# EAGLE design Carte principale v2 (EAGLE 6.3)
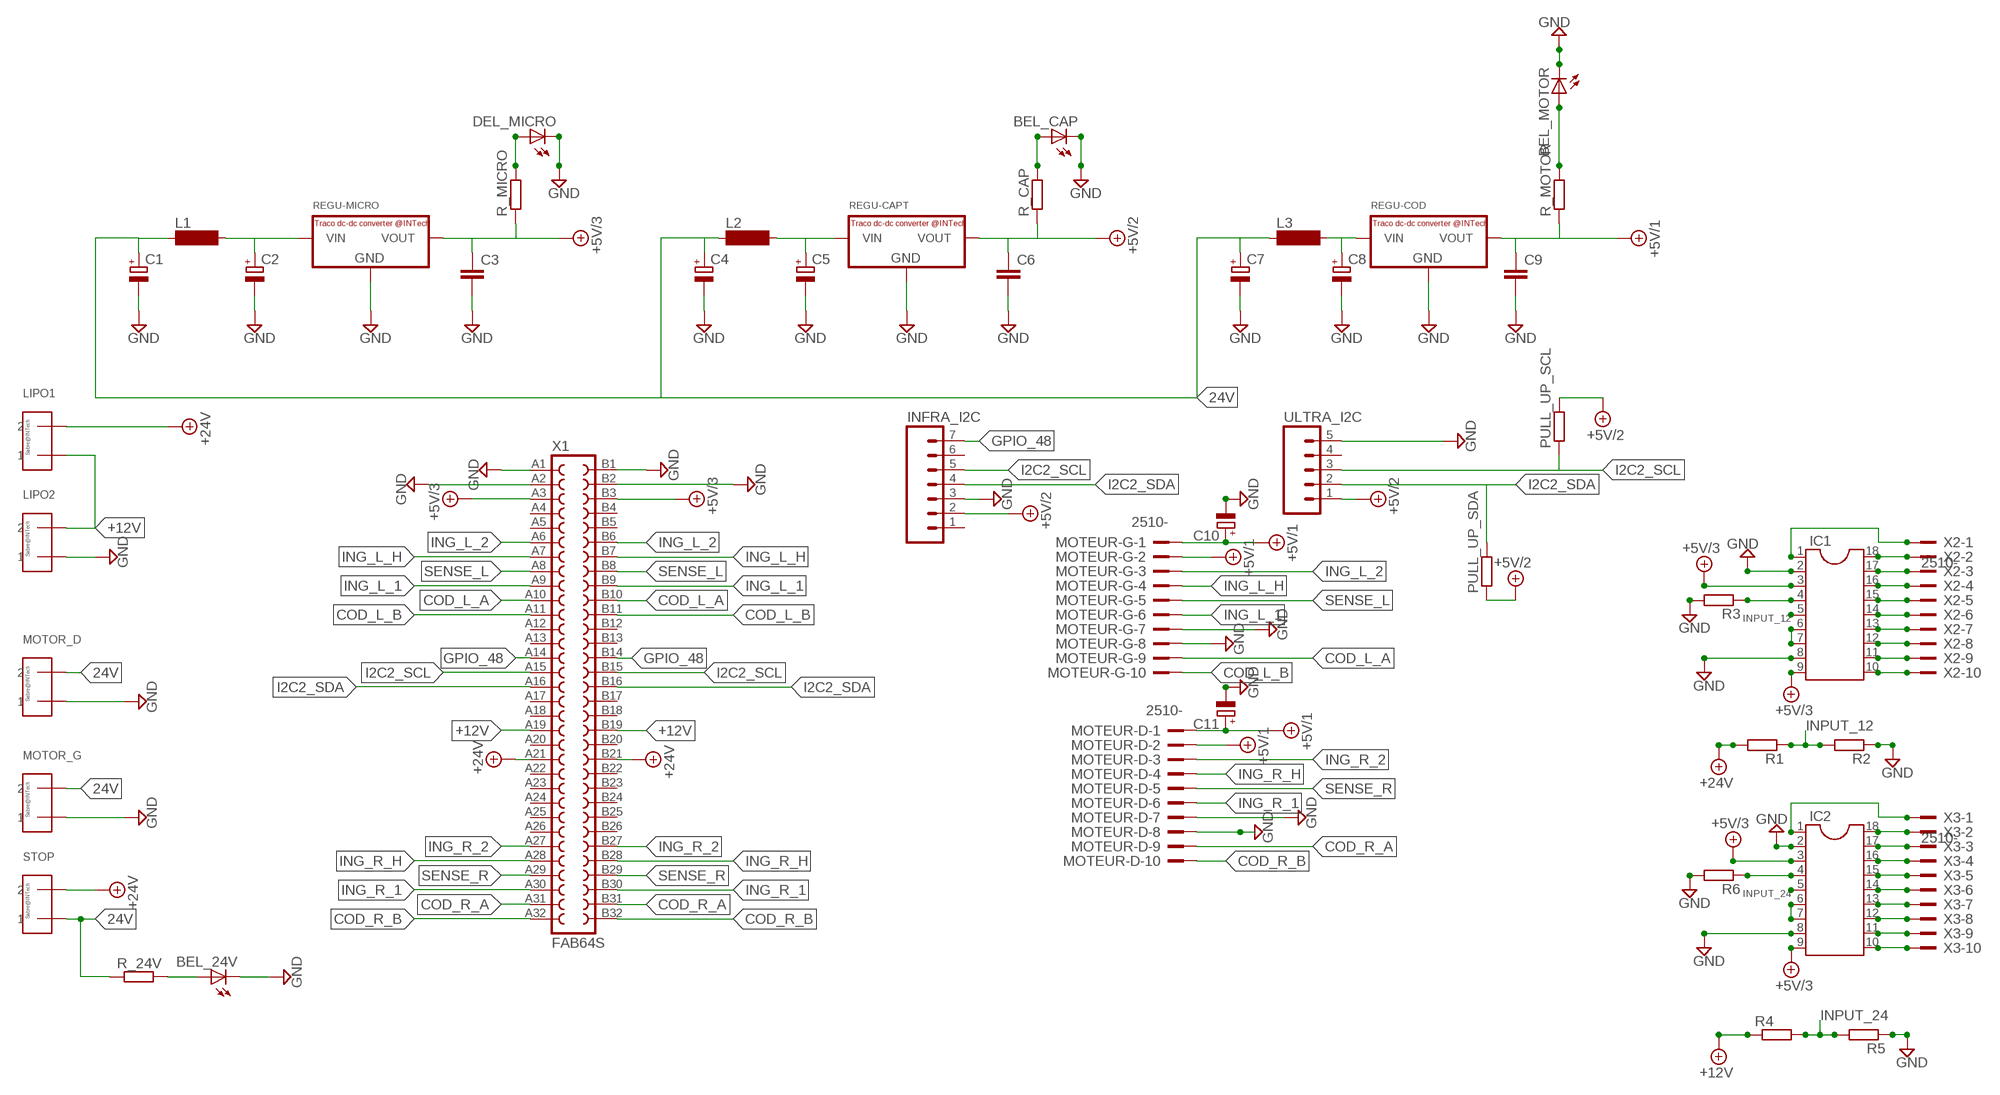
[diagram p0: schematic, sheet 1]

## Parts
BEL_24V  LED5MM  [LED5MM]
BEL_CAP  LED5MM  [LED5MM]
BEL_MOTOR  LED5MM  [LED5MM]
C1  CPOL-EUE2.5-6  [E2,5-6]
C2  CPOL-EUE2.5-6  [E2,5-6]
C3  C-EU050-025X075  [C050-025X075]
C4  CPOL-EUE2.5-6  [E2,5-6]
C5  CPOL-EUE2.5-6  [E2,5-6]
C6  C-EU050-025X075  [C050-025X075]
C7  CPOL-EUE2.5-6  [E2,5-6]
C8  CPOL-EUE2.5-6  [E2,5-6]
C9  C5/3  [C5B3]
C10  CPOL-EUE2.5-6  [E2,5-6]
C11  CPOL-EUE2.5-6  [E2,5-6]
DEL_MICRO  LED5MM  [LED5MM]
IC1  DIL18S  [SOCKET-18]
IC2  DIL18S  [SOCKET-18]
INFRA_I2C  M07  [07P]
L1  SD12-1000  [SD12_1000]
L2  SD12-1000  [SD12_1000]
L3  SD12-1000  [SD12_1000]
LIPO1  43160  [43160]
LIPO2  43160  [43160]
MOTEUR-D  2510-  [PAK100/2500-10]
MOTEUR-G  2510-  [PAK100/2500-10]
MOTOR_D  43160  [43160]
MOTOR_G  43160  [43160]
PULL_UP_SCL  R-EU_0204/7  [0204/7]
PULL_UP_SDA  R-EU_0204/7  [0204/7]
R1  R-EU_0204/7  [0204/7]
R2  R-EU_0204/7  [0204/7]
R3  R-EU_0204/7  [0204/7]
R4  R-EU_0204/7  [0204/7]
R5  R-EU_0204/7  [0204/7]
R6  R-EU_0204/7  [0204/7]
R_24V  R-EU_0204/7  [0204/7]
R_CAP  R-EU_0204/7  [0204/7]
R_MICRO  R-EU_0204/7  [0204/7]
R_MOTOR  R-EU_0204/7  [0204/7]
REGU-CAPT  R-78C-1.0_INTECH  [SIP3_INTECH]
REGU-COD  R-78C-1.0_INTECH  [SIP3_INTECH]
REGU-MICRO  R-78C-1.0_INTECH  [SIP3_INTECH]
STOP  43160  [43160]
ULTRA_I2C  M05  [05P]
X1  FAB64S  [FAB64S]
X2  2510-  [PAK100/2500-10]
X3  2510-  [PAK100/2500-10]

## Nets
24V: C1.+ C4.+ C7.+ L1.1 L2.1 L3.1 MOTOR_D.2_1 MOTOR_D.2_2 MOTOR_G.2_1 MOTOR_G.2_2 R_24V.1 STOP.1_1 STOP.1_2
+5V/1: C9.1 C10.+ C11.+ MOTEUR-D.1 MOTEUR-D.2 MOTEUR-G.1 MOTEUR-G.2 R_MOTOR.1 REGU-COD.VOUT
+5V/2: C6.1 INFRA_I2C.2 PULL_UP_SCL.2 PULL_UP_SDA.1 R_CAP.1 REGU-CAPT.VOUT ULTRA_I2C.1
+5V/3: C3.1 IC1.3 IC1.9 IC2.3 IC2.9 R_MICRO.1 REGU-MICRO.VOUT X1.A3 X1.B3
+12V: LIPO1.1_1 LIPO1.1_2 LIPO2.2_1 LIPO2.2_2 R4.1 X1.A19 X1.B19
+24V: LIPO1.2_1 LIPO1.2_2 R1.2 STOP.2_1 STOP.2_2 X1.A21 X1.B21
COD_L_A: MOTEUR-G.9 X1.A10 X1.B10
COD_L_B: MOTEUR-G.10 X1.A11 X1.B11
COD_R_A: MOTEUR-D.9 X1.A31 X1.B31
COD_R_B: MOTEUR-D.10 X1.A32 X1.B32
GND: BEL_24V.K(C) BEL_CAP.K(C) BEL_MOTOR.K(C) C1.- C2.- C3.2 C4.- C5.- C6.2 C7.- C8.- C9.2 C10.- C11.- DEL_MICRO.K(C) IC1.2 IC1.8 IC2.2 IC2.8 INFRA_I2C.3 LIPO2.1_1 LIPO2.1_2 MOTEUR-D.7 MOTEUR-D.8 MOTEUR-G.7 MOTEUR-G.8 MOTOR_D.1_1 MOTOR_D.1_2 MOTOR_G.1_1 MOTOR_G.1_2 R2.1 R3.2 R5.1 R6.2 REGU-CAPT.GND REGU-COD.GND REGU-MICRO.GND ULTRA_I2C.5 X1.A1 X1.A2 X1.B1 X1.B2
GPIO_48: INFRA_I2C.7 X1.A14 X1.B14
I2C2_SCL: INFRA_I2C.5 PULL_UP_SCL.1 ULTRA_I2C.3 X1.A15 X1.B15
I2C2_SDA: INFRA_I2C.4 PULL_UP_SDA.2 ULTRA_I2C.2 X1.A16 X1.B16
ING_L_1: MOTEUR-G.6 X1.A9 X1.B9
ING_L_2: MOTEUR-G.3 X1.A6 X1.B6
ING_L_H: MOTEUR-G.4 X1.A7 X1.B7
ING_R_1: MOTEUR-D.6 X1.A30 X1.B30
ING_R_2: MOTEUR-D.3 X1.A27 X1.B27
ING_R_H: MOTEUR-D.4 X1.A28 X1.B28
INPUT_12: IC1.5 R1.1 R2.2
INPUT_24: IC2.5 R4.2 R5.2
N$1: DEL_MICRO.A R_MICRO.2
N$2: BEL_24V.A R_24V.2
N$3: C8.+ L3.2 REGU-COD.VIN
N$4: C2.+ L1.2 REGU-MICRO.VIN
N$6: C5.+ L2.2 REGU-CAPT.VIN
N$8: BEL_CAP.A R_CAP.2
N$10: IC1.6 IC1.7
N$12: IC1.12 X2.8
N$13: IC1.13 X2.7
N$14: BEL_MOTOR.A R_MOTOR.2
N$18: IC1.17 X2.3
N$20: IC1.15 X2.5
N$21: IC1.14 X2.6
N$24: IC1.11 X2.9
N$25: IC1.10 X2.10
N$26: IC1.16 X2.4
N$28: IC2.6 IC2.7
N$29: IC1.18 X2.2
N$30: IC1.1 X2.1
N$31: IC2.10 X3.10
N$32: IC2.11 X3.9
N$33: IC2.12 X3.8
N$34: IC2.13 X3.7
N$44: IC2.14 X3.6
N$45: IC2.15 X3.5
N$46: IC2.16 X3.4
N$47: IC2.17 X3.3
N$48: IC2.18 X3.2
N$49: IC2.1 X3.1
N$52: IC1.4 R3.1
N$54: IC2.4 R6.1
SENSE_L: MOTEUR-G.5 X1.A8 X1.B8
SENSE_R: MOTEUR-D.5 X1.A29 X1.B29
Unconnected: INFRA_I2C.1 INFRA_I2C.6 ULTRA_I2C.4 X1.A4 X1.A5 X1.A12 X1.A13 X1.A17 X1.A18 X1.A20 X1.A22 X1.A23 X1.A24 X1.A25 X1.A26 X1.B4 X1.B5 X1.B12 X1.B13 X1.B17 X1.B18 X1.B20 X1.B22 X1.B23 X1.B24 X1.B25 X1.B26

## Library data of the parts
BEL_24V BEL_CAP BEL_MOTOR DEL_MICRO = led:LED: LED OSRAM: - CHIPLED LG R971, LG N971, LY N971, LG Q971, LY Q971, LO R971, LY R971 LH N974, LH R974 LS Q976, LO Q976, LY Q976 LO Q996 - Hyper CHIPLED LW Q18S LB Q993, LB Q99A, LB R99A - SideLED LS A670, LO A670, LY A670, LG A670, LP A670 LB A673, LV A673, LT A673, LW A673 LH A674 LY A675 LS A676, LA A676, LO A676, LY A676, LW A676 LS A679, LY A679, LG A679 - Hyper Micro SIDELED® LS Y876, LA Y876, LO Y876, LY Y876 LT Y87S - SmartLED LW L88C, LW L88S LB L89C, LB L89S, LG L890 LS L89K, LO L89K, LY L89K LS L896, LA L896, LO L896, LY L896 - TOPLED LS T670, LO T670, LY T670, LG T670, LP T670 LSG T670, LSP T670, LSY T670, LOP T670, LYG T670 LG T671, LOG T671, LSG T671 LB T673, LV T673, LT T673, LW T673 LH T674 LS T676, LA T676, LO T676, LY T676, LB T676, LH T676, LSB T676, LW T676 LB T67C, LV T67C, LT T67C, LS T67K, LO T67K, LY T67K, LW E67C LS E67B, LA E67B, LO E67B, LY E67B, LB E67C, LV E67C, LT E67C LW T67C LS T679, LY T679, LG T679 LS T770, LO T770, LY T770, LG T770, LP T770 LB T773, LV T773, LT T773, LW T773 LH T774 LS E675, LA E675, LY E675, LS T675 LS T776, LA T776, LO T776, LY T776, LB T776 LHGB T686 LT T68C, LB T68C - Hyper Mini TOPLED® LB M676 - Mini TOPLED Santana® LG M470 LS M47K, LO M47K, LY M47K Source: http://www.osram.convergy.de LUXEON: - LUMILED® LXK2-PW12-R00, LXK2-PW12-S00, LXK2-PW14-U00, LXK2-PW14-V00 LXK2-PM12-R00, LXK2-PM12-S00, LXK2-PM14-U00 LXK2-PE12-Q00, LXK2-PE12-R00, LXK2-PE12-S00, LXK2-PE14-T00, LXK2-PE14-U00 LXK2-PB12-K00, LXK2-PB12-L00, LXK2-PB12-M00, LXK2-PB14-N00, LXK2-PB14-P00, LXK2-PB14-Q00 LXK2-PR12-L00, LXK2-PR12-M00, LXK2-PR14-Q00, LXK2-PR14-R00 LXK2-PD12-Q00, LXK2-PD12-R00, LXK2-PD12-S00 LXK2-PH12-R00, LXK2-PH12-S00 LXK2-PL12-P00, LXK2-PL12-Q00, LXK2-PL12-R00 Source: www.luxeon.com KINGBRIGHT: KA-3528ASYC Source: www.kingbright.com
C1 C2 C4 C5 C7 C8 C10 C11 = resistor:CPOL-EU: POLARIZED CAPACITOR, European symbol
C3 C6 = resistor:C-EU: CAPACITOR, European symbol
C9 = capacitor-wima:C: CAPACITOR naming: grid - package width
IC1 IC2 = ic-package:DIL18: Dual In Line / Socket
INFRA_I2C = con-amp-quick:M07: AMP QUICK CONNECTOR; OC_FARNELL: unknown; OC_NEWARK: unknown
L1-L3 = inductor-neosid:SD12: INDUCTOR nominal inductance; OC_FARNELL: unknown; OC_NEWARK: unknown
LIPO1 LIPO2 MOTOR_D MOTOR_G STOP = con-molex-sabre:43160: Connecteur Molex Sabre, Droit, 2 contacts, 7.49 mm
MOTEUR-D MOTEUR-G X2 X3 = con-3m:2510-: 3M (TM) Pak 100 4-Wall Header Source: 3M; MF: 3M; MPN: 2510-6002UB; OC_FARNELL: 9838244; OC_NEWARK: 46F4725
PULL_UP_SCL PULL_UP_SDA R1-R6 R_24V R_CAP R_MICRO R_MOTOR = resistor:R-EU_: RESISTOR, European symbol
REGU-CAPT REGU-COD REGU-MICRO = INTech:R-78C*-1.0_INTECH: Convertisseur dc-dc Traco
ULTRA_I2C = con-amp-quick:M05: AMP QUICK CONNECTOR; OC_FARNELL: unknown; OC_NEWARK: unknown
X1 = con-vg:FAB64S: CONNECTOR female, 64 pins, block, type B, rows AB, grid 2.54 mm

## Board
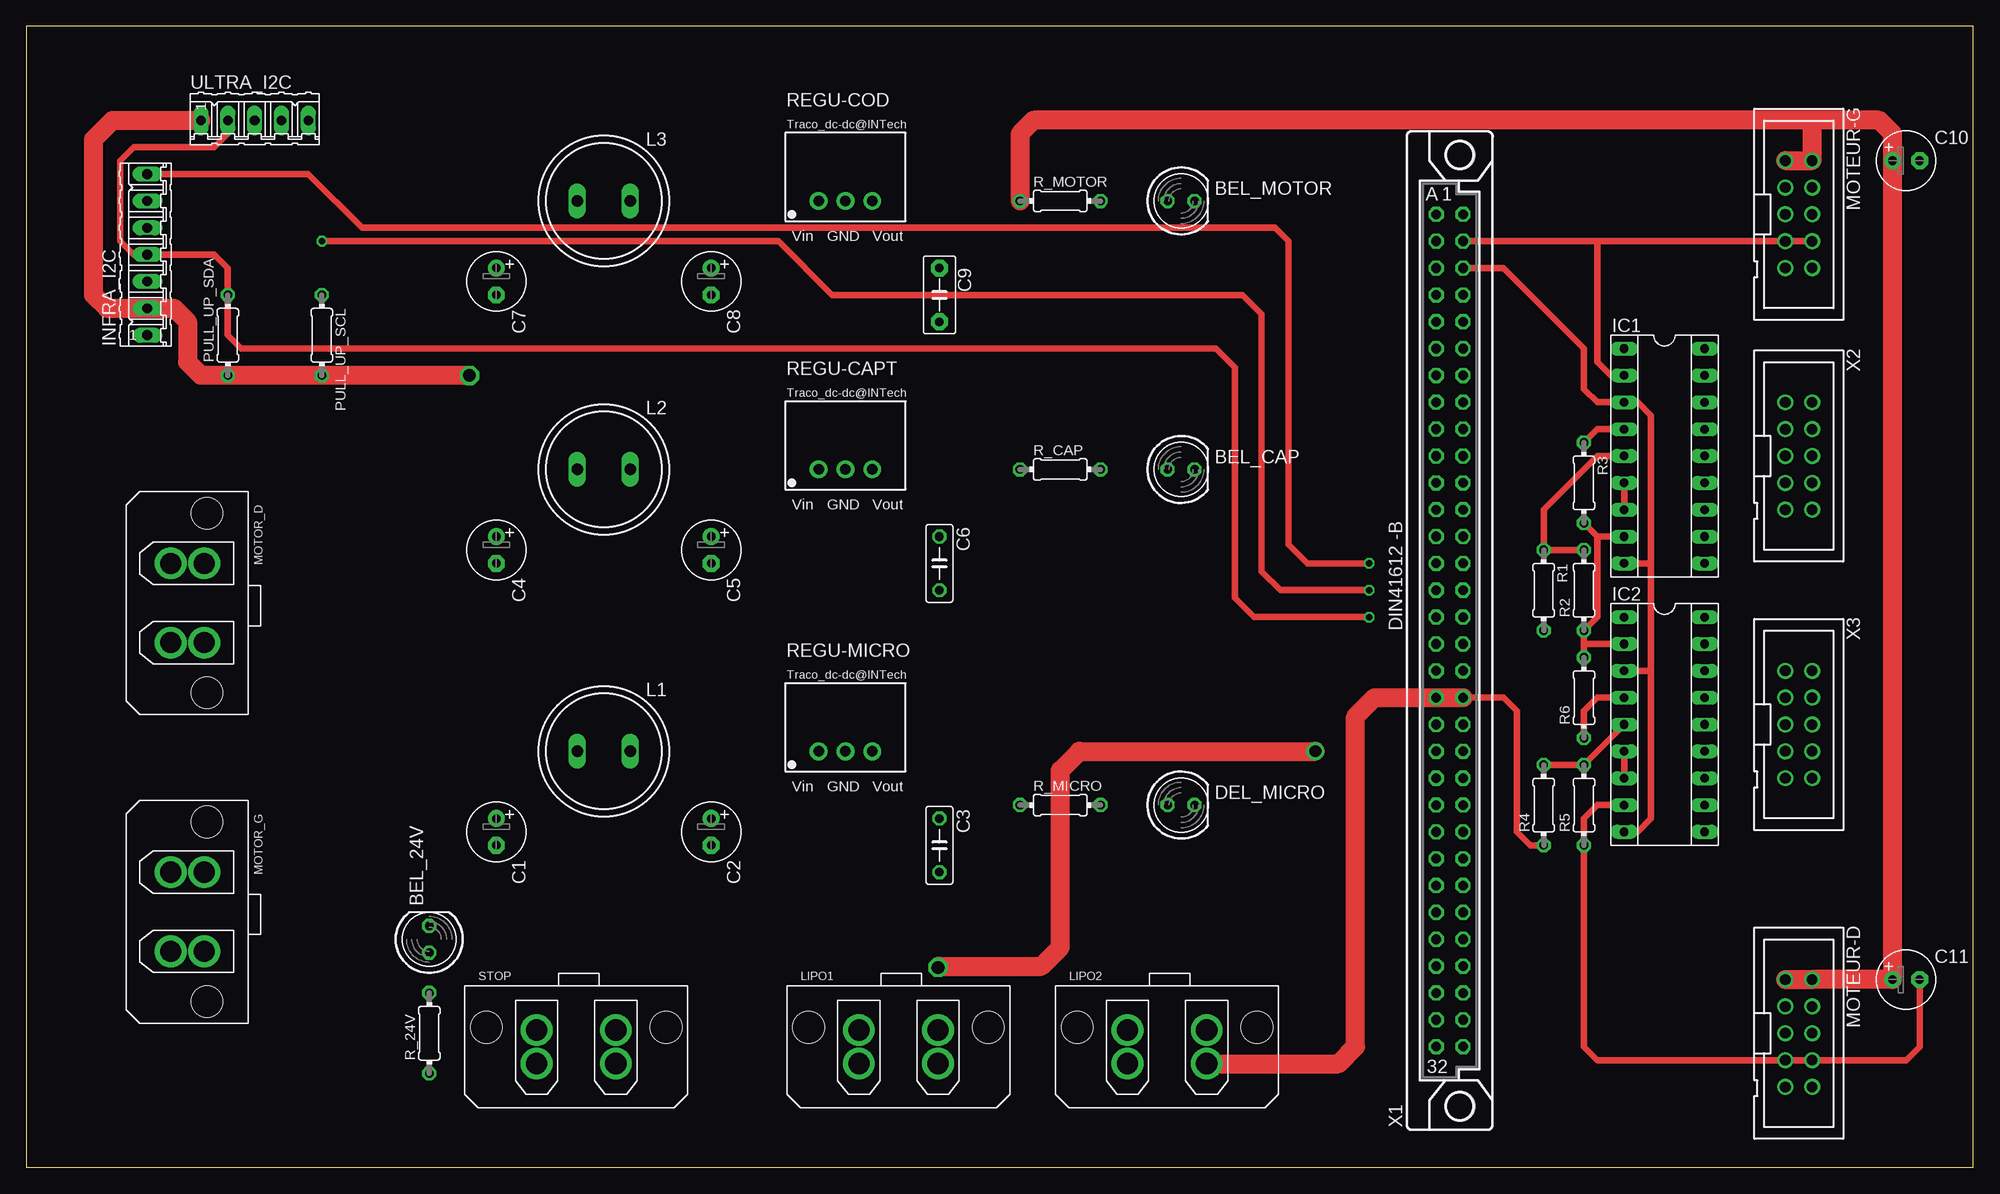
[diagram p1: board, top side]
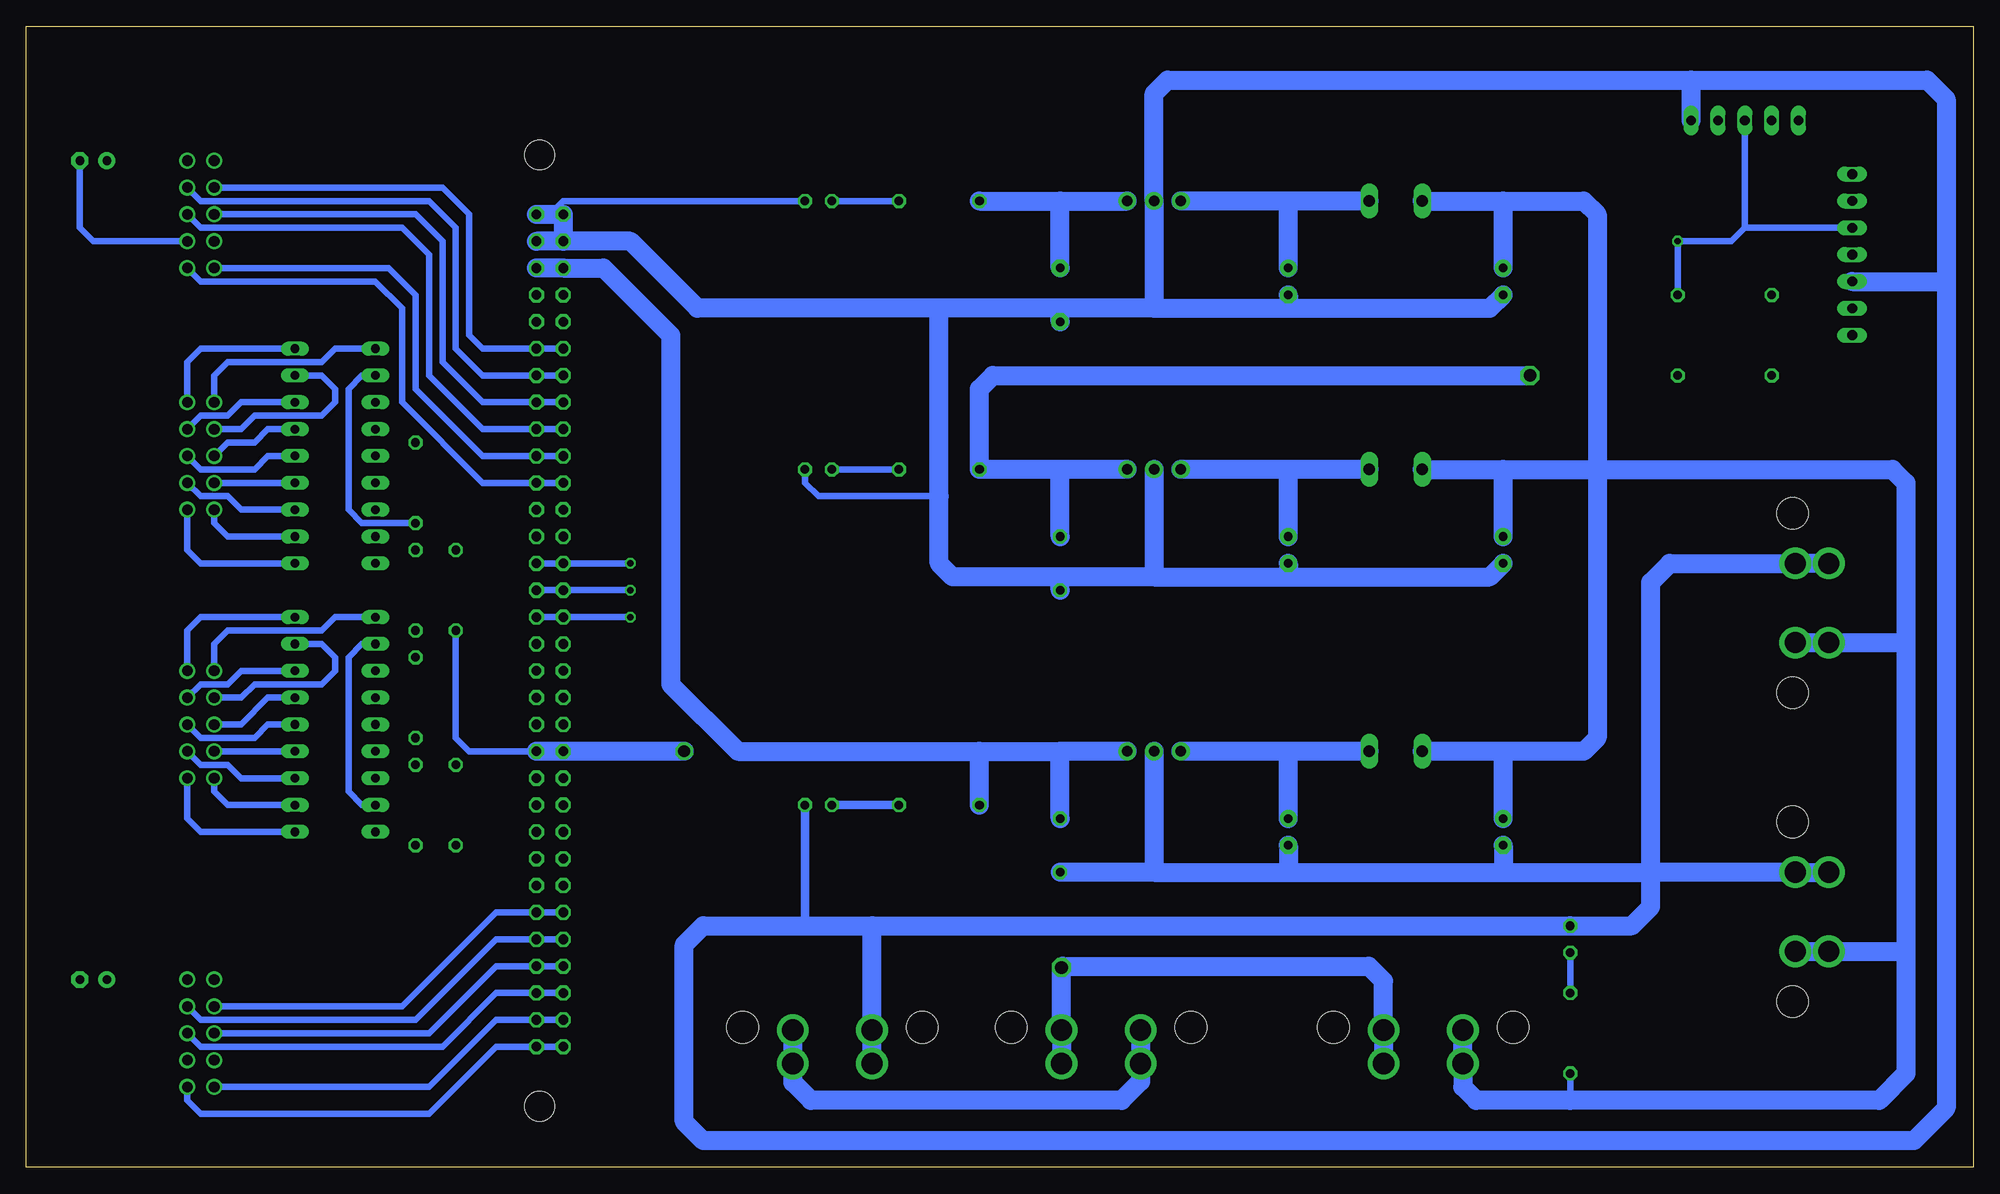
[diagram p2: board, bottom side, seen from below]

Size 184.13 x 107.95 mm. Coordinates in mm from the lower left corner, seen from the top.
Outline: 0,0 184.13,0 184.13,107.95 0,107.95 0,0
Copper layers (1*16): Top 0.035mm / dielectric 1.5mm / Bottom 0.035mm
Design rules "default *": minimum track width 8mil, minimum drill 20mil, track to track 8mil, track to pad 8mil, pad to pad 8mil, via to via 8mil, smd to smd 8mil, copper to edge 8mil, drill to drill 8mil, minimum pad ring 10mil, minimum via ring 8mil, stop-mask expansion 4mil, vias tented up to drill 0mil, thermal gap 10mil

### Footprints (pad centres in the part's own frame; a part is rotated, then mirrored left to right if it is on the bottom)
LED5MM = drill 0.813 octagon: A -1.27,0; K 1.27,0
E2,5-6 = drill 0.813 pad 1.6: + -1.27,0 | drill 0.813 pad 1.6 octagon: - 1.27,0
C050-025X075 = drill 0.813 octagon: 1 -2.54,0; 2 2.54,0
C5B3 = drill 0.813 pad 1.6 octagon: 1 -2.54,0; 2 2.54,0
SOCKET-18 = drill 0.813 long: 1 -10.16,-3.81; 2 -7.62,-3.81; 3 -5.08,-3.81; 4 -2.54,-3.81; 5 0,-3.81; 6 2.54,-3.81; 7 5.08,-3.81; 8 7.62,-3.81; 9 10.16,-3.81; 10 10.16,3.81; 11 7.62,3.81; 12 5.08,3.81; 13 2.54,3.81; 14 0,3.81; 15 -2.54,3.81; 16 -5.08,3.81; 17 -7.62,3.81; 18 -10.16,3.81
07P = drill 0.914 long: 1 -7.62,0; 2 -5.08,0; 3 -2.54,0; 4 0,0; 5 2.54,0; 6 5.08,0; 7 7.62,0
SD12_1000 = drill 1.1 long: 1 -2.5,0; 2 2.5,0
43160 = drill 2: 1_1 -3.81,-1.6; 1_2 -3.81,1.575; 2_1 3.683,-1.6; 2_2 3.683,1.575 | hole 3: -8.56,1.829; 8.433,1.829
PAK100/2500-10 = drill 1 pad 1.422: 1 -5.08,-1.27; 2 -5.08,1.27; 3 -2.54,-1.27; 4 -2.54,1.27; 5 0,-1.27; 6 0,1.27; 7 2.54,-1.27; 8 2.54,1.27; 9 5.08,-1.27; 10 5.08,1.27
0204/7 = drill 0.813 octagon: 1 -3.81,0; 2 3.81,0
SIP3_INTECH = drill 1 pad 1.676: GND 0,0; VIN -2.54,0; VOUT 2.54,0
05P = drill 0.914 long: 1 -5.08,0; 2 -2.54,0; 3 0,0; 4 2.54,0; 5 5.08,0
FAB64S = drill 0.914 octagon: A1 -1.27,39.37; A2 -1.27,36.83; A3 -1.27,34.29; A4 -1.27,31.75; A5 -1.27,29.21; A6 -1.27,26.67; A7 -1.27,24.13; A8 -1.27,21.59; A9 -1.27,19.05; A10 -1.27,16.51; A11 -1.27,13.97; A12 -1.27,11.43; A13 -1.27,8.89; A14 -1.27,6.35; A15 -1.27,3.81; A16 -1.27,1.27; A17 -1.27,-1.27; A18 -1.27,-3.81; A19 -1.27,-6.35; A20 -1.27,-8.89; A21 -1.27,-11.43; A22 -1.27,-13.97; A23 -1.27,-16.51; A24 -1.27,-19.05; A25 -1.27,-21.59; A26 -1.27,-24.13; A27 -1.27,-26.67; A28 -1.27,-29.21; A29 -1.27,-31.75; A30 -1.27,-34.29; A31 -1.27,-36.83; A32 -1.27,-39.37; B1 1.27,39.37; B2 1.27,36.83; B3 1.27,34.29; B4 1.27,31.75; B5 1.27,29.21; B6 1.27,26.67; B7 1.27,24.13; B8 1.27,21.59; B9 1.27,19.05; B10 1.27,16.51; B11 1.27,13.97; B12 1.27,11.43; B13 1.27,8.89; B14 1.27,6.35; B15 1.27,3.81; B16 1.27,1.27; B17 1.27,-1.27; B18 1.27,-3.81; B19 1.27,-6.35; B20 1.27,-8.89; B21 1.27,-11.43; B22 1.27,-13.97; B23 1.27,-16.51; B24 1.27,-19.05; B25 1.27,-21.59; B26 1.27,-24.13; B27 1.27,-26.67; B28 1.27,-29.21; B29 1.27,-31.75; B30 1.27,-34.29; B31 1.27,-36.83; B32 1.27,-39.37 | hole 2.794: 0.965,-45.009; 0.965,45.009

### Placement (x,y rotation side)
BEL_24V  38.1,21.59 90 top
BEL_CAP  109.22,66.04 0 top
BEL_MOTOR  109.22,91.44 0 top
C1  44.45,31.75 270 top
C2  64.77,31.75 270 top
C3  86.36,30.48 270 top
C4  44.45,58.42 270 top
C5  64.77,58.42 270 top
C6  86.36,57.15 270 top
C7  44.45,83.82 270 top
C8  64.77,83.82 270 top
C9  86.36,82.55 270 top
C10  177.8,95.25 0 top
C11  177.8,17.78 0 top
DEL_MICRO  109.22,34.29 0 top
IC1  154.94,67.31 270 top
IC2  154.94,41.91 270 top
INFRA_I2C  11.43,86.36 90 top
L1  54.61,39.37 0 top
L2  54.61,66.04 0 top
L3  54.61,91.44 0 top
LIPO1  82.55,11.43 0 top
LIPO2  107.95,11.43 0 top
MOTEUR-D  167.64,12.7 270 top
MOTEUR-G  167.64,90.17 270 top
MOTOR_D  15.24,53.34 270 top
MOTOR_G  15.24,24.13 270 top
PULL_UP_SCL  27.94,78.74 270 top
PULL_UP_SDA  19.05,78.74 90 top
R1  143.51,54.61 270 top
R2  147.32,54.61 90 top
R3  147.32,64.77 270 top
R4  143.51,34.29 90 top
R5  147.32,34.29 90 top
R6  147.32,44.45 90 top
R_24V  38.1,12.7 90 top
R_CAP  97.79,66.04 0 top
R_MICRO  97.79,34.29 0 top
R_MOTOR  97.79,91.44 0 top
REGU-CAPT  77.47,66.04 0 top
REGU-COD  77.47,91.44 0 top
REGU-MICRO  77.47,39.37 0 top
STOP  52.07,11.43 0 top
ULTRA_I2C  21.59,99.06 0 top
X1  134.62,50.8 0 top
X2  167.64,67.31 270 top
X3  167.64,41.91 270 top

### Tracks (layer width: path | path; a pad name or v marks a point on that pad's centre or on a via)
24V
  Bottom 0.61: R_24V.1 38.1,6.35
  Bottom 1.778: STOP.1_2 STOP.1_1 48.26,7.62 46.99,6.35 38.1,6.35 8.89,6.35 6.35,8.89 6.35,20.32 | L2.1 44.45,66.04 | 35.56,66.04 7.62,66.04 6.35,64.77 6.35,49.53 | 6.35,49.53 6.35,20.32 | C4.+ 44.45,66.04 | L3.1 44.45,91.44 | 44.45,91.44 36.83,91.44 35.56,90.17 35.56,66.04 | 35.56,66.04 35.56,40.64 36.83,39.37 44.45,39.37 | 44.45,39.37 L1.1 | C1.+ 44.45,39.37 | C7.+ 44.45,91.44 | 44.45,66.04 35.56,66.04 | MOTOR_G.2_2 MOTOR_G.2_1 6.48,20.45 6.35,20.32 | MOTOR_D.2_2 MOTOR_D.2_1 6.48,49.66 6.35,49.53
+5V/1
  Top 1.778: MOTEUR-G.1 MOTEUR-G.2 168.91,99.06 | 168.91,99.06 175.26,99.06 176.53,97.79 C10.+ C11.+ MOTEUR-D.2 MOTEUR-D.1 | 168.91,99.06 95.25,99.06 93.98,97.79 R_MOTOR.1
  Bottom 1.778: R_MOTOR.1 86.36,91.44 | 86.36,91.44 REGU-COD.VOUT | C9.1 86.36,91.44
+5V/2  (via drill 1.2)
  Top 1.778: v41.91,74.93 PULL_UP_SCL.2 PULL_UP_SDA.1 16.51,74.93 15.24,76.2 15.24,80.01 13.97,81.28 INFRA_I2C.2 7.62,81.28 6.35,82.55 6.35,97.26 8.15,99.06 ULTRA_I2C.1
  Bottom 1.778: REGU-CAPT.VOUT 86.36,66.04 | 86.36,66.04 R_CAP.1 93.98,73.66 92.71,74.93 v41.91,74.93 | C6.1 86.36,66.04
+5V/3
  Top 0.61: X1.B3 139.7,85.09 147.32,77.47 147.32,73.66 148.59,72.39 IC1.3 152.4,72.39 153.67,71.12 153.67,57.15 | 153.67,57.15 153.67,46.99 | 153.67,46.99 153.67,33.02 152.4,31.75 IC2.9 | IC2.3 153.67,46.99 | IC1.9 153.67,57.15
  Bottom 1.778: REGU-MICRO.VOUT 86.36,39.37 | C3.1 86.36,39.37 | 93.98,39.37 116.84,39.37 123.19,45.72 123.19,78.74 129.54,85.09 X1.A3 X1.B3 | 93.98,39.37 86.36,39.37 | R_MICRO.1 93.98,39.37
+12V
  Top 0.61: X1.B19 139.7,44.45 140.97,43.18 140.97,31.75 142.24,30.48 R4.1
  Top 1.778: X1.B19 X1.A19 127.53,44.45 125.73,42.65 125.73,11.43 124.13,9.83 LIPO2.2_1
  Bottom 1.27: LIPO1.1_1 LIPO1.1_2 | LIPO2.2_2 111.76,13.01
  Bottom 1.778: LIPO2.2_2 LIPO2.2_1 111.63,8.06 109.92,6.35 80.54,6.35 78.74,8.15 LIPO1.1_2
+24V  (via drill 1.1, 1.2)
  Top 1.778: v121.92,39.37 99.59,39.37 97.79,37.57 97.79,20.85 95.99,19.05 86.36,19.05 v86.23,18.92
  Bottom 0.61: X1.B21 142.24,39.37 143.51,40.64 R1.2
  Bottom 1.778: LIPO1.2_1 LIPO1.2_2 v86.23,18.92 86.11,19.05 57.15,19.05 55.75,17.65 STOP.2_2 STOP.2_1 | v121.92,39.37 X1.A21 X1.B21
COD_L_A
  Bottom 0.61: X1.A10 X1.B10 140.97,67.31 147.32,73.66 147.32,82.55 149.86,85.09 MOTEUR-G.9
COD_L_B
  Bottom 0.61: X1.A11 X1.B11 140.97,64.77 148.59,72.39 148.59,81.28 151.13,83.82 167.64,83.82 MOTEUR-G.10
COD_R_A
  Bottom 0.61: X1.A31 X1.B31 139.7,13.97 146.05,7.62 MOTEUR-D.9
COD_R_B
  Bottom 0.61: X1.A32 X1.B32 139.7,11.43 146.05,5.08 167.64,5.08 168.91,6.35 MOTEUR-D.10
GND
  Top 0.61: MOTEUR-G.8 MOTEUR-G.7 148.59,87.63 | C11.- 179.07,11.43 177.8,10.16 MOTEUR-D.8 MOTEUR-D.7 148.59,10.16 147.32,11.43 R5.1 147.32,33.02 148.59,34.29 IC2.8 | X1.B2 148.59,87.63 | 148.59,87.63 148.59,76.2 149.86,74.93 IC1.2 | R6.2 147.32,49.53 | 147.32,49.53 R2.1 148.59,52.07 148.59,59.69 | IC2.2 147.32,49.53 | R3.2 148.59,59.69 | 148.59,59.69 IC1.8
  Bottom 0.61: ULTRA_I2C.5 26.67,99.8 | BEL_CAP.K 110.49,64.77 109.22,63.5 97.79,63.5 | BEL_MOTOR.K 133.35,91.44 134.62,90.17 X1.A1 | C10.- 179.07,88.9 177.8,87.63 MOTEUR-G.8 | R3.2 152.4,60.96 153.67,62.23 153.67,73.66 152.4,74.93 IC1.2 | IC2.8 152.4,34.29 153.67,35.56 153.67,48.26 152.4,49.53 IC2.2
  Bottom 0.813: DEL_MICRO.K 110.49,22.86
  Bottom 1.778: 77.47,27.94 C3.2 | REGU-MICRO.GND 77.47,27.94 | REGU-CAPT.GND 77.47,55.88 | X1.B1 X1.A1 X1.A2 | LIPO2.1_1 LIPO2.1_2 104.14,22.86 | MOTOR_D.1_1 MOTOR_D.1_2 28.68,57.15 30.48,55.35 30.48,27.94 | MOTOR_G.1_1 MOTOR_G.1_2 30.48,27.94 | X1.A2 X1.B2 | 104.14,22.86 BEL_24V.K 32.28,22.86 30.48,24.66 30.48,27.94 | 97.79,81.28 120.65,81.28 127,87.63 X1.A2 | 2.54,83.82 2.54,101.07 4.34,102.87 26.67,102.87 | 2.54,83.82 2.54,5.61 5.61,2.54 120.12,2.54 121.92,4.34 121.92,21.06 120.12,22.86 110.49,22.86 104.14,22.86 | INFRA_I2C.3 2.54,83.82 | 26.67,102.87 76.2,102.87 77.47,101.6 REGU-COD.GND 77.47,81.28 | ULTRA_I2C.5 26.67,102.87 | 77.47,55.88 64.77,55.88 | 64.77,55.88 45.72,55.88 C4.- | C5.- 64.77,55.88 | 77.47,81.28 64.77,81.28 | 64.77,81.28 45.72,81.28 C7.- | C8.- 64.77,81.28 | 77.47,27.94 64.77,27.94 | 64.77,27.94 44.45,27.94 | 44.45,27.94 30.48,27.94 | C1.- 44.45,27.94 | C2.- 64.77,27.94 | 97.79,81.28 97.79,63.5 97.79,57.15 96.52,55.88 86.36,55.88 | 77.47,55.88 86.36,55.88 | C6.2 86.36,55.88 | 77.47,81.28 86.36,81.28 | 86.36,81.28 97.79,81.28 | C9.2 86.36,81.28
GPIO_48  (via drill 0.6)
  Top 0.61: v127,57.15 121.18,57.15 119.38,58.95 119.38,87.63 118.11,88.9 31.75,88.9 26.67,93.98 INFRA_I2C.7
  Bottom 0.61: v127,57.15 X1.A14 X1.B14
I2C2_SCL  (via drill 0.6)
  Top 0.61: v127,54.61 118.64,54.61 116.84,56.41 116.84,80.75 115.04,82.55 76.2,82.55 71.12,87.63 v27.94,87.63
  Bottom 0.61: v127,54.61 X1.A15 X1.B15 | INFRA_I2C.5 21.59,88.9 | ULTRA_I2C.3 21.59,88.9 | 21.59,88.9 22.86,87.63 v27.94,87.63 PULL_UP_SCL.1
I2C2_SDA  (via drill 0.6)
  Top 0.61: v127,52.07 116.1,52.07 114.3,53.87 114.3,75.67 112.5,77.47 20.32,77.47 19.05,78.74 PULL_UP_SDA.2 19.05,85.09 17.78,86.36 INFRA_I2C.4 10.16,86.36 8.89,87.63 8.89,95.25 10.16,96.52 17.78,96.52 19.05,97.79 ULTRA_I2C.2
  Bottom 0.61: v127,52.07 X1.A16 X1.B16
ING_L_1
  Bottom 0.61: X1.A9 X1.B9 140.97,69.85 146.05,74.93 146.05,86.36 148.59,88.9 167.64,88.9 MOTEUR-G.6
ING_L_2
  Bottom 0.61: X1.A6 X1.B6 140.97,77.47 142.24,78.74 142.24,90.17 144.78,92.71 MOTEUR-G.3
ING_L_H
  Bottom 0.61: X1.A7 X1.B7 140.97,74.93 143.51,77.47 143.51,88.9 146.05,91.44 167.64,91.44 MOTEUR-G.4
ING_R_1
  Bottom 0.61: X1.A30 X1.B30 139.7,16.51 144.78,11.43 167.64,11.43 MOTEUR-D.6
ING_R_2
  Bottom 0.61: X1.A27 X1.B27 139.7,24.13 148.59,15.24 MOTEUR-D.3
ING_R_H
  Bottom 0.61: X1.A28 X1.B28 139.7,21.59 147.32,13.97 167.64,13.97 MOTEUR-D.4
INPUT_12
  Top 0.61: R2.2 R1.1 143.51,62.23 148.59,67.31 IC1.5
INPUT_24
  Top 0.61: R4.2 R5.2 IC2.5
N$1
  Bottom 0.813: R_MICRO.2 DEL_MICRO.A
N$2
  Bottom 0.61: BEL_24V.A R_24V.2
N$3
  Bottom 1.778: C8.+ 64.77,91.44 | 64.77,91.44 REGU-COD.VIN | L3.2 64.77,91.44
N$4
  Bottom 1.778: L1.2 64.77,39.37 | 64.77,39.37 REGU-MICRO.VIN | C2.+ 64.77,39.37
N$6
  Bottom 1.778: L2.2 64.77,66.04 | 64.77,66.04 REGU-CAPT.VIN | C5.+ 64.77,66.04
N$8
  Bottom 0.61: R_CAP.2 BEL_CAP.A
N$10
  Top 0.61: IC1.7 IC1.6
N$12
  Bottom 0.61: IC1.12 163.83,62.23 165.1,63.5 167.64,63.5 X2.8
N$13
  Bottom 0.61: IC1.13 X2.7
N$14
  Bottom 0.61: R_MOTOR.2 BEL_MOTOR.A
N$18
  Bottom 0.61: IC1.17 156.21,74.93 154.94,73.66 154.94,72.39 156.21,71.12 162.56,71.12 163.83,69.85 X2.3
N$20
  Bottom 0.61: IC1.15 161.29,69.85 162.56,68.58 165.1,68.58 X2.5
N$21
  Bottom 0.61: IC1.14 161.29,67.31 162.56,66.04 167.64,66.04 X2.6
N$24
  Bottom 0.61: IC1.11 165.1,59.69 166.37,60.96 X2.9
N$25
  Bottom 0.61: IC1.10 167.64,57.15 168.91,58.42 X2.10
N$26
  Bottom 0.61: IC1.16 163.83,72.39 165.1,71.12 167.64,71.12 X2.4
N$28
  Top 0.61: IC2.7 IC2.6
N$29
  Bottom 0.61: IC1.18 167.64,77.47 168.91,76.2 X2.2
N$30
  Bottom 0.61: IC1.1 154.94,77.47 156.21,76.2 165.1,76.2 166.37,74.93 X2.1
N$31
  Bottom 0.61: IC2.10 167.64,31.75 168.91,33.02 X3.10
N$32
  Bottom 0.61: IC2.11 165.1,34.29 166.37,35.56 X3.9
N$33
  Bottom 0.61: IC2.12 163.83,36.83 165.1,38.1 167.64,38.1 X3.8
N$34
  Bottom 0.61: IC2.13 X3.7
N$44
  Bottom 0.61: IC2.14 161.29,41.91 162.56,40.64 167.64,40.64 X3.6
N$45
  Bottom 0.61: IC2.15 161.29,44.45 163.83,41.91 X3.5
N$46
  Bottom 0.61: IC2.16 163.83,46.99 165.1,45.72 167.64,45.72 X3.4
N$47
  Bottom 0.61: IC2.17 156.21,49.53 154.94,48.26 154.94,46.99 156.21,45.72 162.56,45.72 163.83,44.45 X3.3
N$48
  Bottom 0.61: IC2.18 167.64,52.07 168.91,50.8 X3.2
N$49
  Bottom 0.61: IC2.1 154.94,52.07 156.21,50.8 165.1,50.8 166.37,49.53 X3.1
N$52
  Top 0.61: R3.1 148.59,69.85 IC1.4
N$54
  Top 0.61: R6.1 147.32,43.18 148.59,44.45 IC2.4
SENSE_L
  Bottom 0.61: X1.A8 X1.B8 140.97,72.39 144.78,76.2 144.78,87.63 147.32,90.17 MOTEUR-G.5
SENSE_R
  Bottom 0.61: X1.A29 X1.B29 139.7,19.05 146.05,12.7 MOTEUR-D.5

### Text on the board
Document: +5V | SDA | SCL | GND | A1 | L3 | IO_48 | Ultrasons | SCL | C7 | C8 | C9 | SDA | R_COD | GND | 1.+5V / 3.IN2 / 5.SENSE / 7.GND / 9.CODA | 2.+5V / 4.INH / 6.IN1 / 8.GND / 10.CODB | +5V | DEL Debug / Alim codeuses | Moteur gauche | régulateur 5V / allimentation / commande moteur | Infrarouges | Pull-Up SDA | Pull-Up SCL | L2 | Connectique capteur | R3 | LM3914 | C4 | C5 | C6 | R_Capt | Témoin 12 V | GND | DEL Debug / Alim capteurs | régulateur 5V / alimentation capteur | R1 | R2 | +24V | L1 | Moteur droit | R6 | LM3914 | C1 | C2 | C3 | R4 | R5 | Témoin 24 V | R_Micro | GND | régulateur 5V / allimentation / système de contôle | Témoins batterie | DEL Debug / Alim micro | Alimentation générale | +24V | Arrêt d'urgence | Moteur gauche | Alimentation moteurs | DEL Debug / Alim 24V | 1.+5V / 3.IN2 / 5.SENSE / 7.GND / 9.CODA | 2.+5V / 4.INH / 6.IN1 / 8.GND / 10.CODB | Moteur droit | OUT | IN | +12V | +24V | GND | +12V | A32
Sérigraphie: HERMES PHI - SMCF / CARTE PRINCIPALE